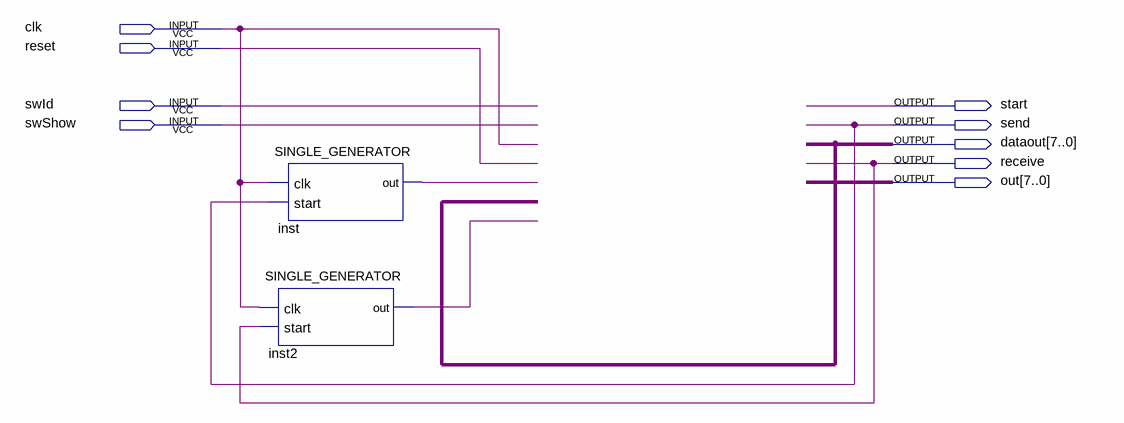
[diagram p0: schematic sheet]
// Quartus schematic BMP180_SHM.bdf as structural Verilog: 2 symbols, 9 pins
module BMP180_SHM (
  input  clk,
  input  reset,
  input  swId,
  input  swShow,
  output start,
  output send,
  output [7:0] dataout,
  output receive,
  output [7:0] out
);

  wire inst2_out, inst_out;

  SINGLE_GENERATOR inst (.clk(clk), .start(send), .out(inst_out));
  SINGLE_GENERATOR inst2 (.clk(clk), .start(receive), .out(inst2_out));
endmodule
